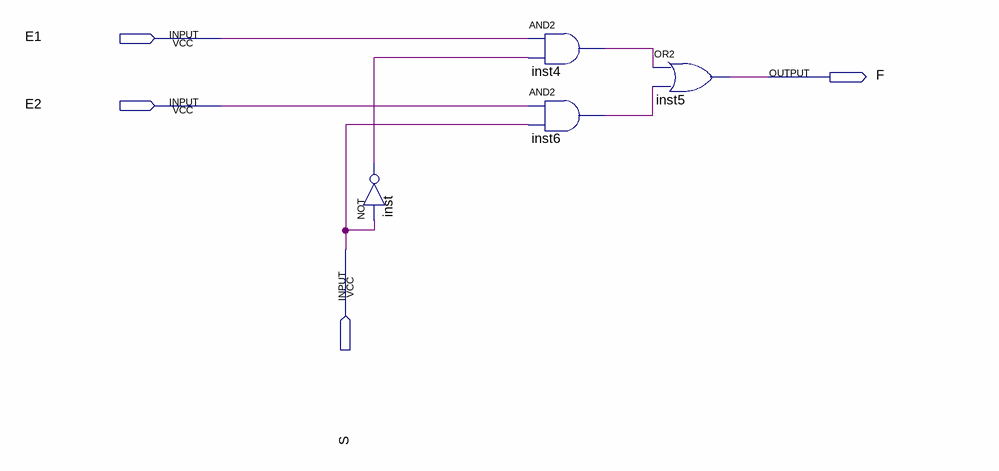
[diagram p0: schematic sheet]
// Quartus schematic MUX1bit.bdf as structural Verilog: 4 symbols, 4 pins
module MUX1bit (
  input  E1,
  input  E2,
  input  S,
  output F
);

  wire inst4_out, inst6_out, inst_out;

  not inst (inst_out, S);
  and inst4 (inst4_out, E1, inst_out);
  and inst6 (inst6_out, E2, S);
  or inst5 (F, inst4_out, inst6_out);
endmodule
